# EAGLE design C2 Rev 1 - C2 Prototype 1 (EAGLE 9.2.2)
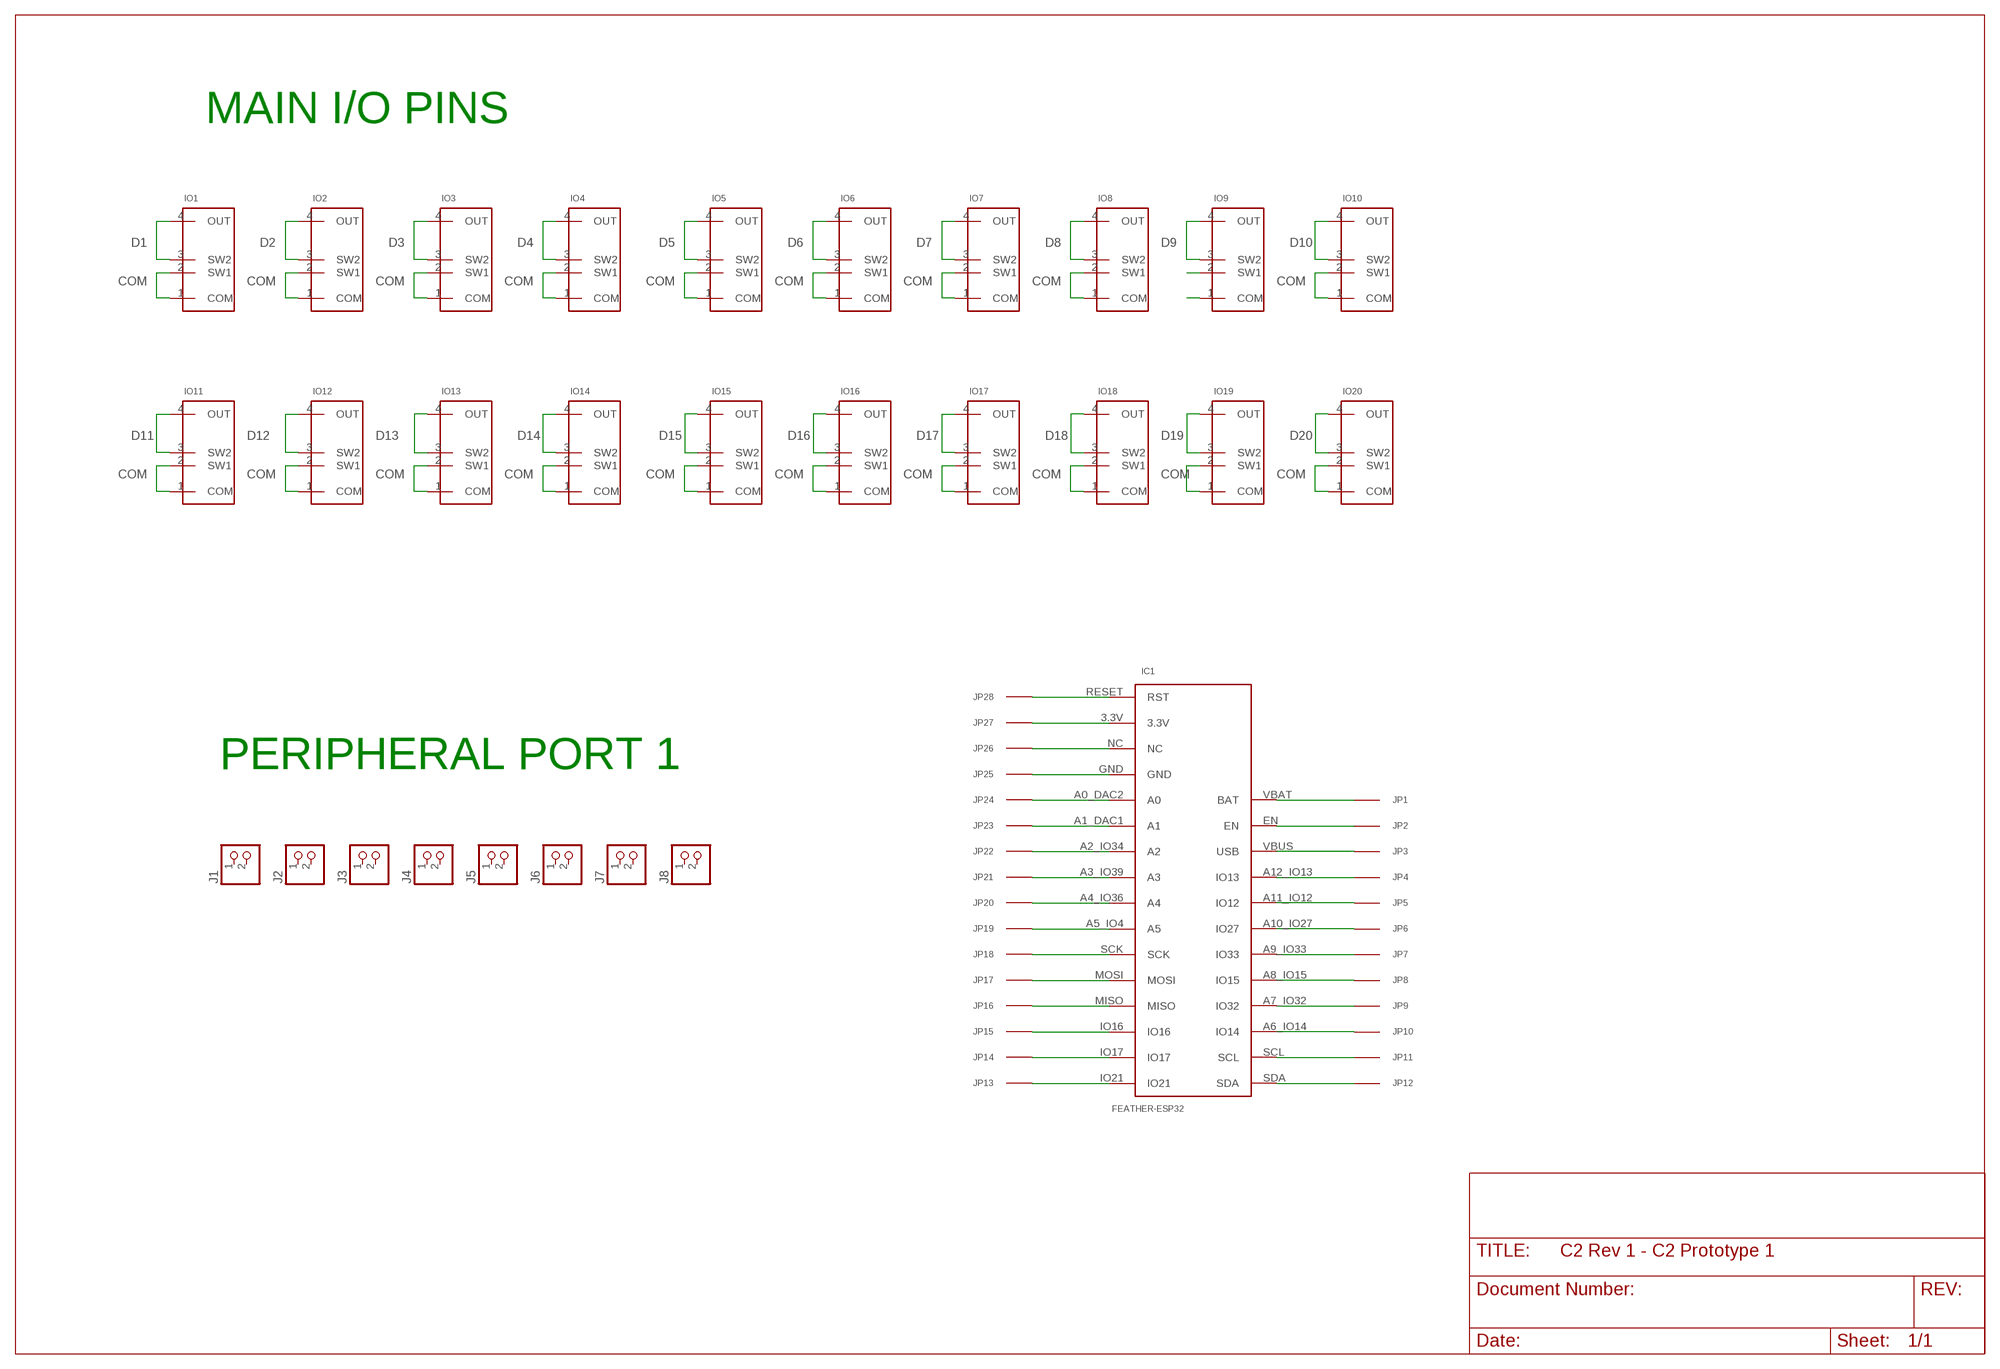
[diagram p0: schematic, sheet 1]

## Parts
IC1  FEATHER-ESP32  [ESP32_FEATHER]
IO1  C2_IO  [C2_IO_VIAS]
IO2  C2_IO  [C2_IO_VIAS]
IO3  C2_IO  [C2_IO_VIAS]
IO4  C2_IO  [C2_IO_VIAS]
IO5  C2_IO  [C2_IO_VIAS]
IO6  C2_IO  [C2_IO_VIAS]
IO7  C2_IO  [C2_IO_VIAS]
IO8  C2_IO  [C2_IO_VIAS]
IO9  C2_IO  [C2_IO_VIAS]
IO10  C2_IO  [C2_IO_VIAS]
IO11  C2_IO  [C2_IO_VIAS]
IO12  C2_IO  [C2_IO_VIAS]
IO13  C2_IO  [C2_IO_VIAS]
IO14  C2_IO  [C2_IO_VIAS]
IO15  C2_IO  [C2_IO_VIAS]
IO16  C2_IO  [C2_IO_VIAS]
IO17  C2_IO  [C2_IO_VIAS]
IO18  C2_IO  [C2_IO_VIAS]
IO19  C2_IO  [C2_IO_VIAS]
IO20  C2_IO  [C2_IO_VIAS]
J1  PINHD-1X2  [1X02]
J2  PINHD-1X2  [1X02]
J3  PINHD-1X2  [1X02]
J4  PINHD-1X2  [1X02]
J5  PINHD-1X2  [1X02]
J6  PINHD-1X2  [1X02]
J7  PINHD-1X2  [1X02]
J8  PINHD-1X2  [1X02]
JP1  PROTO_VIA_COMPACT  [PROTO_VIA]
JP2  PROTO_VIA_COMPACT  [PROTO_VIA]
JP3  PROTO_VIA_COMPACT  [PROTO_VIA]
JP4  PROTO_VIA_COMPACT  [PROTO_VIA]
JP5  PROTO_VIA_COMPACT  [PROTO_VIA]
JP6  PROTO_VIA_COMPACT  [PROTO_VIA]
JP7  PROTO_VIA_COMPACT  [PROTO_VIA]
JP8  PROTO_VIA_COMPACT  [PROTO_VIA]
JP9  PROTO_VIA_COMPACT  [PROTO_VIA]
JP10  PROTO_VIA_COMPACT  [PROTO_VIA]
JP11  PROTO_VIA_COMPACT  [PROTO_VIA]
JP12  PROTO_VIA_COMPACT  [PROTO_VIA]
JP13  PROTO_VIA_COMPACT  [PROTO_VIA]
JP14  PROTO_VIA_COMPACT  [PROTO_VIA]
JP15  PROTO_VIA_COMPACT  [PROTO_VIA]
JP16  PROTO_VIA_COMPACT  [PROTO_VIA]
JP17  PROTO_VIA_COMPACT  [PROTO_VIA]
JP18  PROTO_VIA_COMPACT  [PROTO_VIA]
JP19  PROTO_VIA_COMPACT  [PROTO_VIA]
JP20  PROTO_VIA_COMPACT  [PROTO_VIA]
JP21  PROTO_VIA_COMPACT  [PROTO_VIA]
JP22  PROTO_VIA_COMPACT  [PROTO_VIA]
JP23  PROTO_VIA_COMPACT  [PROTO_VIA]
JP24  PROTO_VIA_COMPACT  [PROTO_VIA]
JP25  PROTO_VIA_COMPACT  [PROTO_VIA]
JP26  PROTO_VIA_COMPACT  [PROTO_VIA]
JP27  PROTO_VIA_COMPACT  [PROTO_VIA]
JP28  PROTO_VIA_COMPACT  [PROTO_VIA]

## Nets
COM: IO1.1(COM) IO1.2(SW1) IO2.1(COM) IO2.2(SW1) IO3.1(COM) IO3.2(SW1) IO4.1(COM) IO4.2(SW1) IO5.1(COM) IO5.2(SW1) IO6.1(COM) IO6.2(SW1) IO7.1(COM) IO7.2(SW1) IO8.1(COM) IO8.2(SW1) IO9.1(COM) IO9.2(SW1) IO10.1(COM) IO10.2(SW1) IO11.1(COM) IO11.2(SW1) IO12.1(COM) IO12.2(SW1) IO13.1(COM) IO13.2(SW1) IO14.1(COM) IO14.2(SW1) IO15.1(COM) IO15.2(SW1) IO16.1(COM) IO16.2(SW1) IO17.1(COM) IO17.2(SW1) IO18.1(COM) IO18.2(SW1) IO19.1(COM) IO19.2(SW1) IO20.1(COM) IO20.2(SW1)
D1: IO1.3(SW2) IO1.4(OUT)
D2: IO2.3(SW2) IO2.4(OUT)
D3: IO3.3(SW2) IO3.4(OUT)
D4: IO4.3(SW2) IO4.4(OUT)
D5: IO5.3(SW2) IO5.4(OUT)
D6: IO6.3(SW2) IO6.4(OUT)
D7: IO7.3(SW2) IO7.4(OUT)
D8: IO8.3(SW2) IO8.4(OUT)
D9: IO9.3(SW2) IO9.4(OUT)
D10: IO10.3(SW2) IO10.4(OUT)
D11: IO11.3(SW2) IO11.4(OUT)
D12: IO12.3(SW2) IO12.4(OUT)
D13: IO13.3(SW2) IO13.4(OUT)
D14: IO14.3(SW2) IO14.4(OUT)
D15: IO15.3(SW2) IO15.4(OUT)
D16: IO16.3(SW2) IO16.4(OUT)
D17: IO17.3(SW2) IO17.4(OUT)
D18: IO18.3(SW2) IO18.4(OUT)
D19: IO19.3(SW2) IO19.4(OUT)
D20: IO20.3(SW2) IO20.4(OUT)
N$1: IC1.RESET(RST) JP28.1
N$2: IC1.3.3V JP27.1
N$3: IC1.NC JP26.1
N$4: IC1.GND JP25.1
N$5: IC1.A0_DAC2(A0) JP24.1
N$6: IC1.A1_DAC1(A1) JP23.1
N$7: IC1.A2_IO34(A2) JP22.1
N$8: IC1.A3_IO39(A3) JP21.1
N$9: IC1.A4_IO36(A4) JP20.1
N$10: IC1.A5_IO4(A5) JP19.1
N$11: IC1.SCK JP18.1
N$12: IC1.MOSI JP17.1
N$13: IC1.MISO JP16.1
N$14: IC1.IO16 JP15.1
N$15: IC1.IO17 JP14.1
N$16: IC1.IO21 JP13.1
N$17: IC1.SDA JP12.1
N$18: IC1.SCL JP11.1
N$19: IC1.A6_IO14(IO14) JP10.1
N$20: IC1.A7_IO32(IO32) JP9.1
N$21: IC1.A8_IO15(IO15) JP8.1
N$22: IC1.A9_IO33(IO33) JP7.1
N$23: IC1.A10_IO27(IO27) JP6.1
N$24: IC1.A11_IO12(IO12) JP5.1
N$25: IC1.A12_IO13(IO13) JP4.1
N$26: IC1.VBUS(USB) JP3.1
N$27: IC1.EN JP2.1
N$28: IC1.VBAT(BAT) JP1.1
Unconnected: J1.1 J1.2 J2.1 J2.2 J3.1 J3.2 J4.1 J4.2 J5.1 J5.2 J6.1 J6.2 J7.1 J7.2 J8.1 J8.2

## Notes on the sheet
- MAIN I/O PINS
- PERIPHERAL PORT 1

## Library data of the parts
IC1 = VCO-Eagle_parts:FEATHER-ESP32
IO1-IO20 = VanEagleLib:C2_IO
J1-J8 = pinhead:PINHD-1X2: PIN HEADER
JP1-JP28 = VanEagleLib:PROTO_VIA_COMPACT

## Board
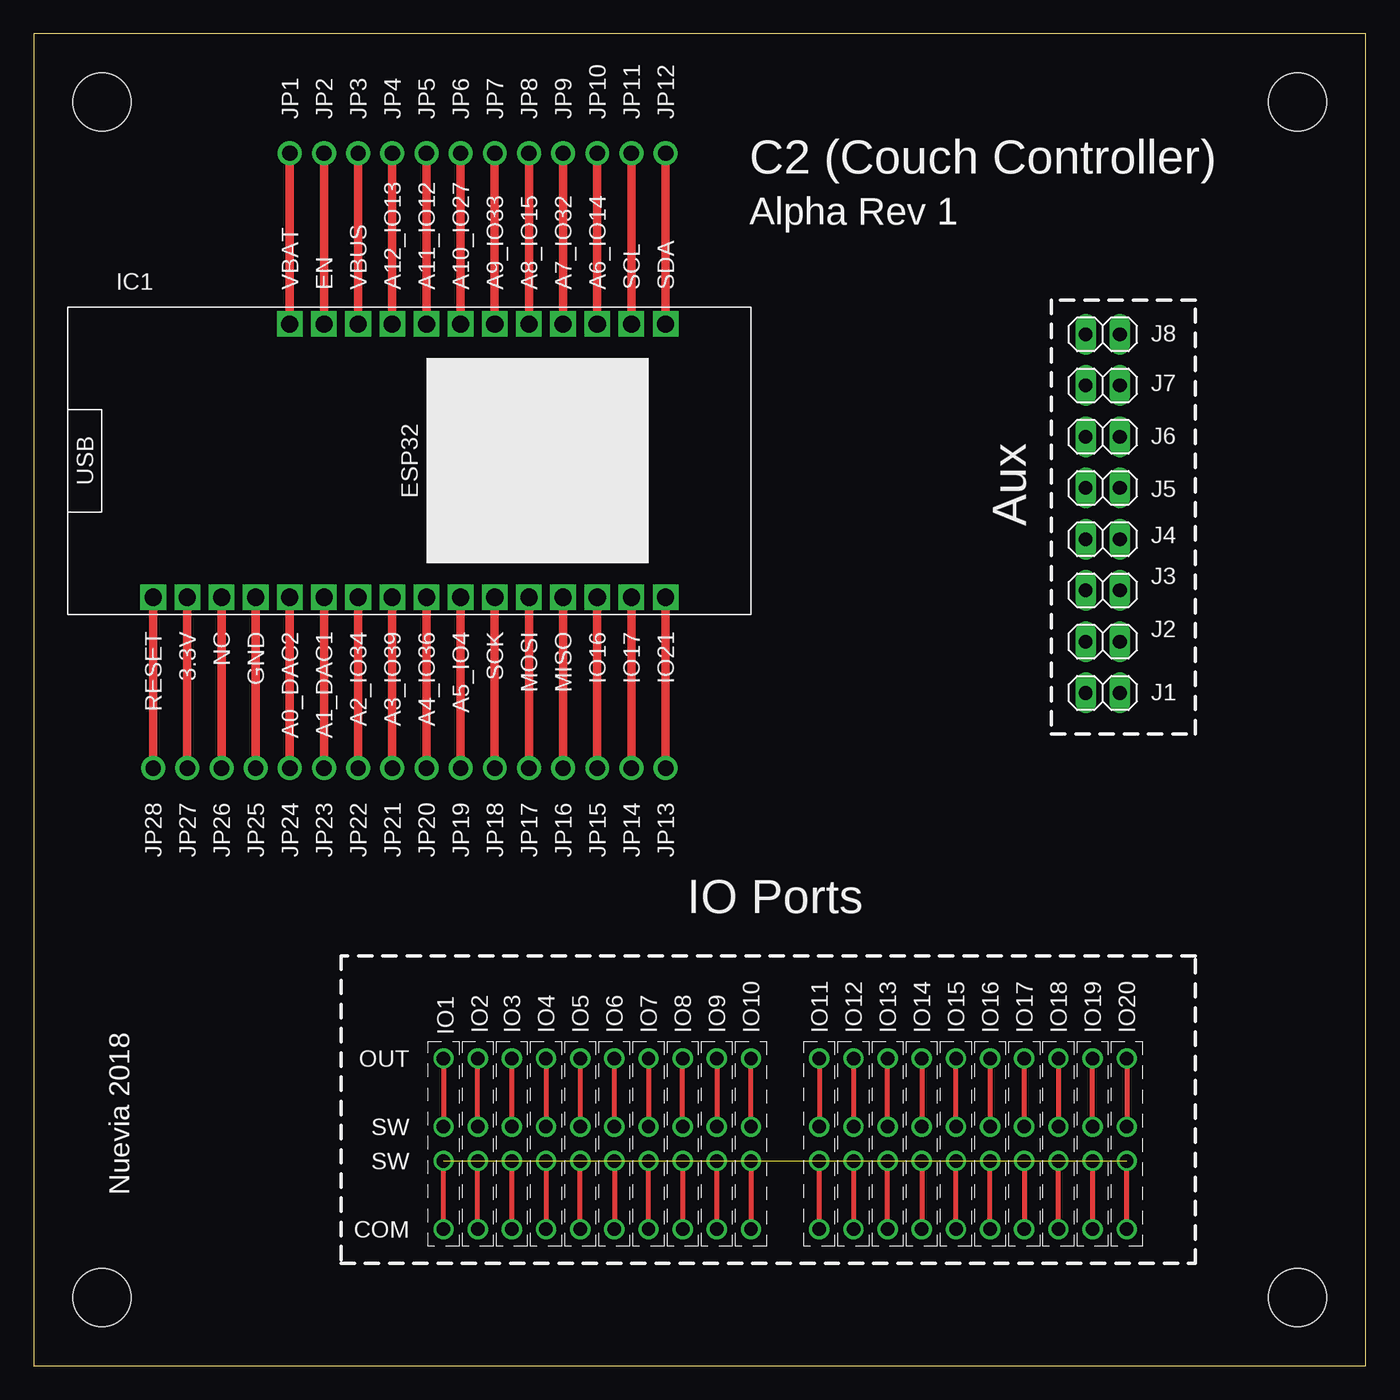
[diagram p1: board, top side]

Size 99.06 x 99.06 mm. Coordinates in mm from the lower left corner, seen from the top.
Outline: 0,0 99.06,0 99.06,99.06 0,99.06 0,0
Copper layers (1*16): Top 0.035mm / dielectric 1.5mm / Bottom 0.035mm
Design rules "default": minimum track width 6mil, minimum drill 0.35mm, track to track 6mil, track to pad 6mil, pad to pad 6mil, via to via 6mil, smd to smd 6mil, copper to edge 40mil, drill to drill 6mil, minimum pad ring 10mil, minimum via ring 8mil, stop-mask expansion 4mil, vias tented up to drill 0mil, thermal gap 10mil
Holes 4.3 mm at 5.08,5.08 93.98,5.08 93.98,93.98 5.08,93.98

### Footprints (pad centres in the part's own frame; a part is rotated, then mirrored left to right if it is on the bottom)
ESP32_FEATHER = drill 1.27 square: 3.3V -10.16,16.51; A0_DAC2 -10.16,8.89; A1_DAC1 -10.16,6.35; A2_IO34 -10.16,3.81; A3_IO39 -10.16,1.27; A4_IO36 -10.16,-1.27; A5_IO4 -10.16,-3.81; A6_IO14 10.16,-13.97; A7_IO32 10.16,-11.43; A8_IO15 10.16,-8.89; A9_IO33 10.16,-6.35; A10_IO27 10.16,-3.81; A11_IO12 10.16,-1.27; A12_IO13 10.16,1.27; EN 10.16,6.35; GND -10.16,11.43; IO16 -10.16,-13.97; IO17 -10.16,-16.51; IO21 -10.16,-19.05; MISO -10.16,-11.43; MOSI -10.16,-8.89; NC -10.16,13.97; RESET -10.16,19.05; SCK -10.16,-6.35; SCL 10.16,-16.51; SDA 10.16,-19.05; VBAT 10.16,8.89; VBUS 10.16,3.81
C2_IO_VIAS = drill 1: 1 0,0; 2 0,5.08; 3 0,7.62; 4 0,12.7
1X02 = drill 1.016 long: 1 -1.27,0; 2 1.27,0
PROTO_VIA = drill 1.143 pad 1.778: 1 0,0

### Placement (x,y rotation side)
IC1  27.94,67.31 90 top
IO1  30.48,10.16 0 top
IO2  33.02,10.16 0 top
IO3  35.56,10.16 0 top
IO4  38.1,10.16 0 top
IO5  40.64,10.16 0 top
IO6  43.18,10.16 0 top
IO7  45.72,10.16 0 top
IO8  48.26,10.16 0 top
IO9  50.8,10.16 0 top
IO10  53.34,10.16 0 top
IO11  58.42,10.16 0 top
IO12  60.96,10.16 0 top
IO13  63.5,10.16 0 top
IO14  66.04,10.16 0 top
IO15  68.58,10.16 0 top
IO16  71.12,10.16 0 top
IO17  73.66,10.16 0 top
IO18  76.2,10.16 0 top
IO19  78.74,10.16 0 top
IO20  81.28,10.16 0 top
J1  79.5,50.04 180 top
J2  79.5,53.85 180 top
J3  79.5,57.66 180 top
J4  79.5,61.47 180 top
J5  79.5,65.28 180 top
J6  79.5,69.09 180 top
J7  79.5,72.9 180 top
J8  79.5,76.71 180 top
JP1  19.05,90.17 90 top
JP2  21.59,90.17 90 top
JP3  24.13,90.17 90 top
JP4  26.67,90.17 90 top
JP5  29.21,90.17 90 top
JP6  31.75,90.17 90 top
JP7  34.29,90.17 90 top
JP8  36.83,90.17 90 top
JP9  39.37,90.17 90 top
JP10  41.91,90.17 90 top
JP11  44.45,90.17 90 top
JP12  46.99,90.17 90 top
JP13  46.99,44.45 270 top
JP14  44.45,44.45 270 top
JP15  41.91,44.45 270 top
JP16  39.37,44.45 270 top
JP17  36.83,44.45 270 top
JP18  34.29,44.45 270 top
JP19  31.75,44.45 270 top
JP20  29.21,44.45 270 top
JP21  26.67,44.45 270 top
JP22  24.13,44.45 270 top
JP23  21.59,44.45 270 top
JP24  19.05,44.45 270 top
JP25  16.51,44.45 270 top
JP26  13.97,44.45 270 top
JP27  11.43,44.45 270 top
JP28  8.89,44.45 270 top

### Tracks (layer width: path | path; a pad name or v marks a point on that pad's centre or on a via)
COM  (19 unrouted)
  Top 0.381: IO1.1 IO1.2 | IO3.1 IO3.2 | IO4.2 IO4.1 | IO2.1 IO2.2 | IO5.1 IO5.2 | IO6.2 IO6.1 | IO7.1 IO7.2 | IO8.2 IO8.1 | IO9.1 IO9.2 | IO10.2 IO10.1 | IO11.1 IO11.2 | IO12.2 IO12.1 | IO13.1 IO13.2 | IO14.2 IO14.1 | IO15.1 IO15.2 | IO16.1 IO16.2 | IO17.2 IO17.1 | IO18.1 IO18.2 | IO19.2 IO19.1 | IO20.1 IO20.2
D1
  Top 0.381: IO1.4 IO1.3
D2
  Top 0.381: IO2.3 IO2.4
D3
  Top 0.381: IO3.3 IO3.4
D4
  Top 0.381: IO4.4 IO4.3
D5
  Top 0.381: IO5.4 IO5.3
D6
  Top 0.381: IO6.3 IO6.4
D7
  Top 0.381: IO7.4 IO7.3
D8
  Top 0.381: IO8.3 IO8.4
D9
  Top 0.381: IO9.4 IO9.3
D10
  Top 0.381: IO10.3 IO10.4
D11
  Top 0.381: IO11.4 IO11.3
D12
  Top 0.381: IO12.4 IO12.3
D13
  Top 0.381: IO13.3 IO13.4
D14
  Top 0.381: IO14.4 IO14.3
D15
  Top 0.381: IO15.3 IO15.4
D16
  Top 0.381: IO16.4 IO16.3
D17
  Top 0.381: IO17.3 IO17.4
D18
  Top 0.381: IO18.4 IO18.3
D19
  Top 0.381: IO19.3 IO19.4
D20
  Top 0.381: IO20.4 IO20.3
N$1
  Top 0.635: IC1.RESET JP28.1
N$2
  Top 0.635: JP27.1 IC1.3.3V
N$3
  Top 0.635: IC1.NC JP26.1
N$4
  Top 0.635: JP25.1 IC1.GND
N$5
  Top 0.635: IC1.A0_DAC2 JP24.1
N$6
  Top 0.635: JP23.1 IC1.A1_DAC1
N$7
  Top 0.635: IC1.A2_IO34 JP22.1
N$8
  Top 0.635: JP21.1 IC1.A3_IO39
N$9
  Top 0.635: IC1.A4_IO36 JP20.1
N$10
  Top 0.635: JP19.1 IC1.A5_IO4
N$11
  Top 0.635: IC1.SCK JP18.1
N$12
  Top 0.635: JP17.1 IC1.MOSI
N$13
  Top 0.635: IC1.MISO JP16.1
N$14
  Top 0.635: JP15.1 IC1.IO16
N$15
  Top 0.635: IC1.IO17 JP14.1
N$16
  Top 0.635: JP13.1 IC1.IO21
N$17
  Top 0.635: JP12.1 IC1.SDA
N$18
  Top 0.635: IC1.SCL JP11.1
N$19
  Top 0.635: JP10.1 IC1.A6_IO14
N$20
  Top 0.635: IC1.A7_IO32 JP9.1
N$21
  Top 0.635: JP8.1 IC1.A8_IO15
N$22
  Top 0.635: IC1.A9_IO33 JP7.1
N$23
  Top 0.635: IC1.A10_IO27 JP6.1
N$24
  Top 0.635: IC1.A11_IO12 JP5.1
N$25
  Top 0.635: IC1.A12_IO13 JP4.1
N$26
  Top 0.635: IC1.VBUS JP3.1
N$27
  Top 0.635: IC1.EN JP2.1
N$28
  Top 0.635: JP1.1 IC1.VBAT

### Text on the board
tPlace: C2 (Couch Controller) | Alpha Rev 1 | Aux | IO Ports | OUT | SW | SW | Nuevia 2018 | COM